# EAGLE board SDA381V7_B1 (EAGLE 9.6.2), part 1 of 11
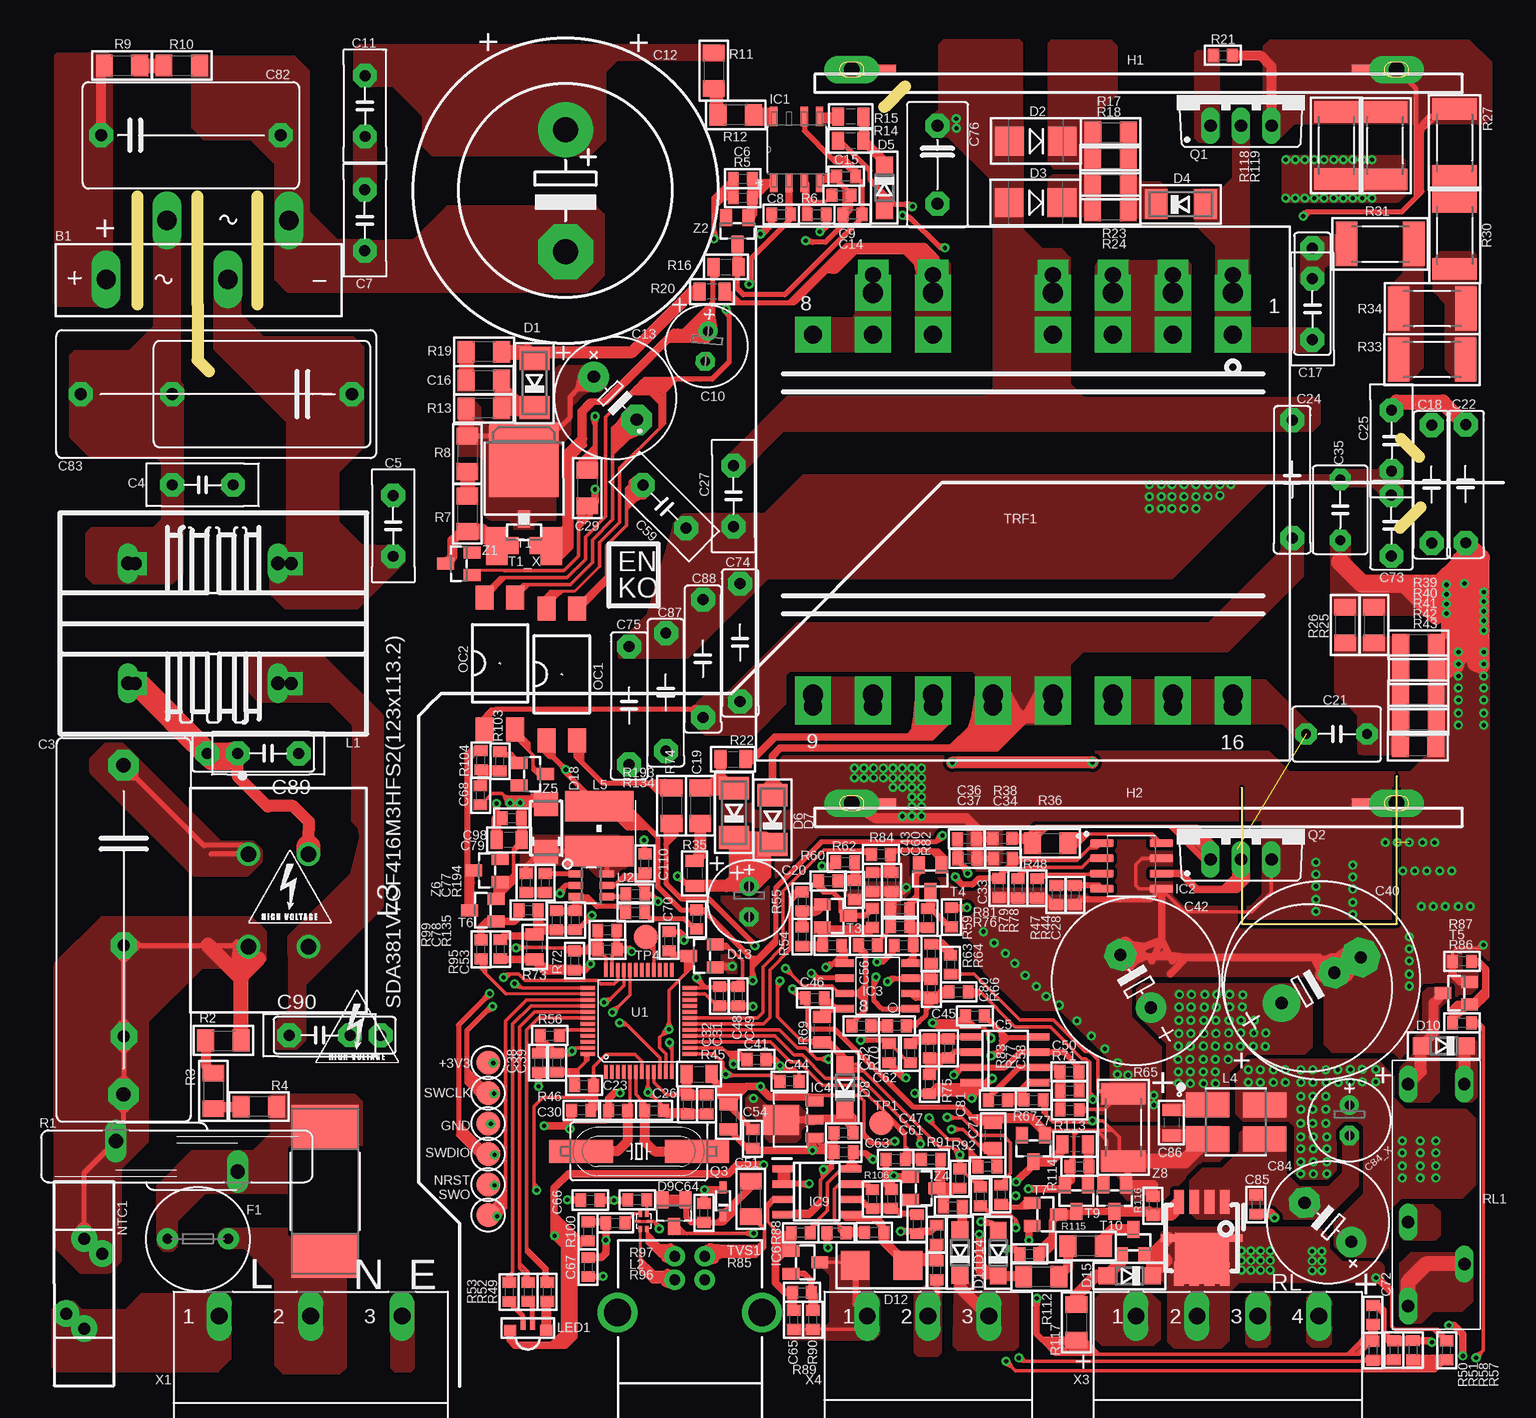
[diagram p2: board, top side]
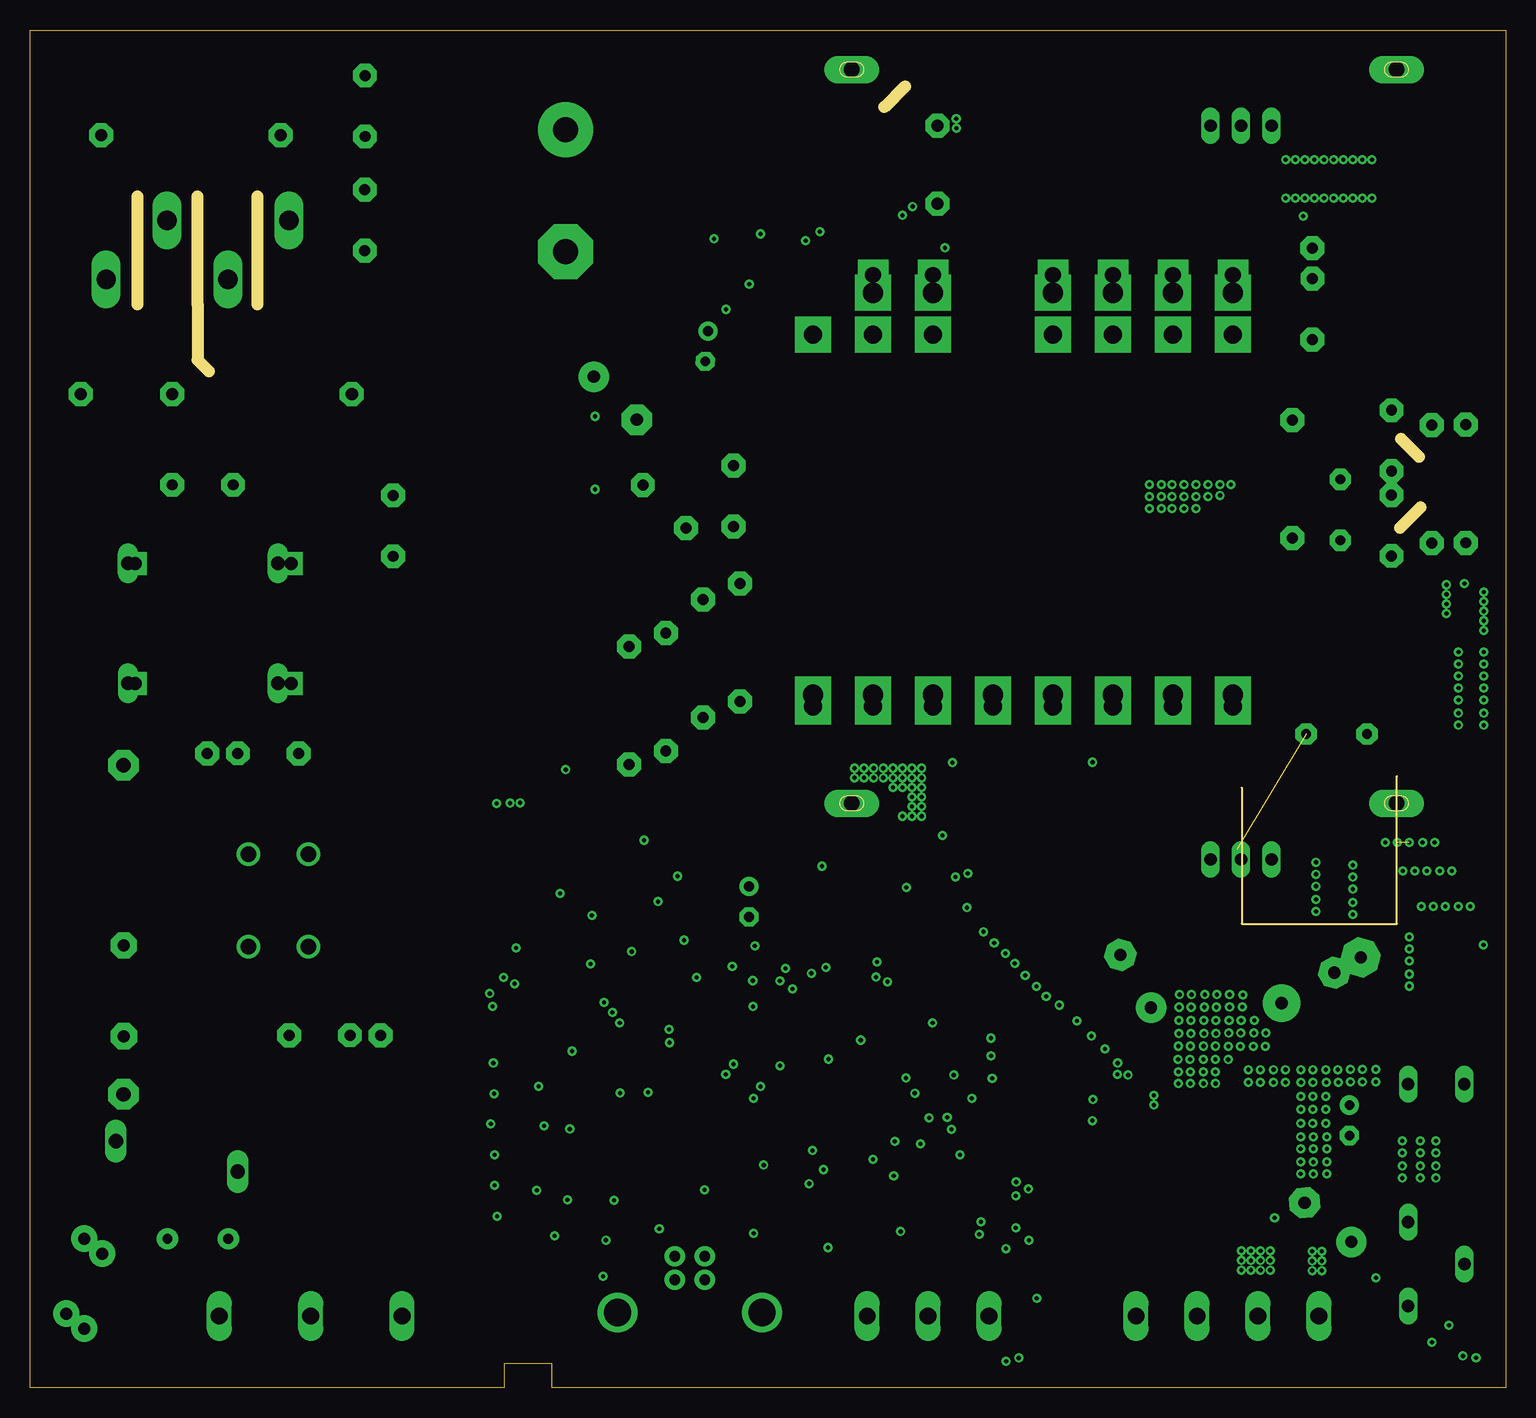
[diagram p3: board, inner layer Route3]
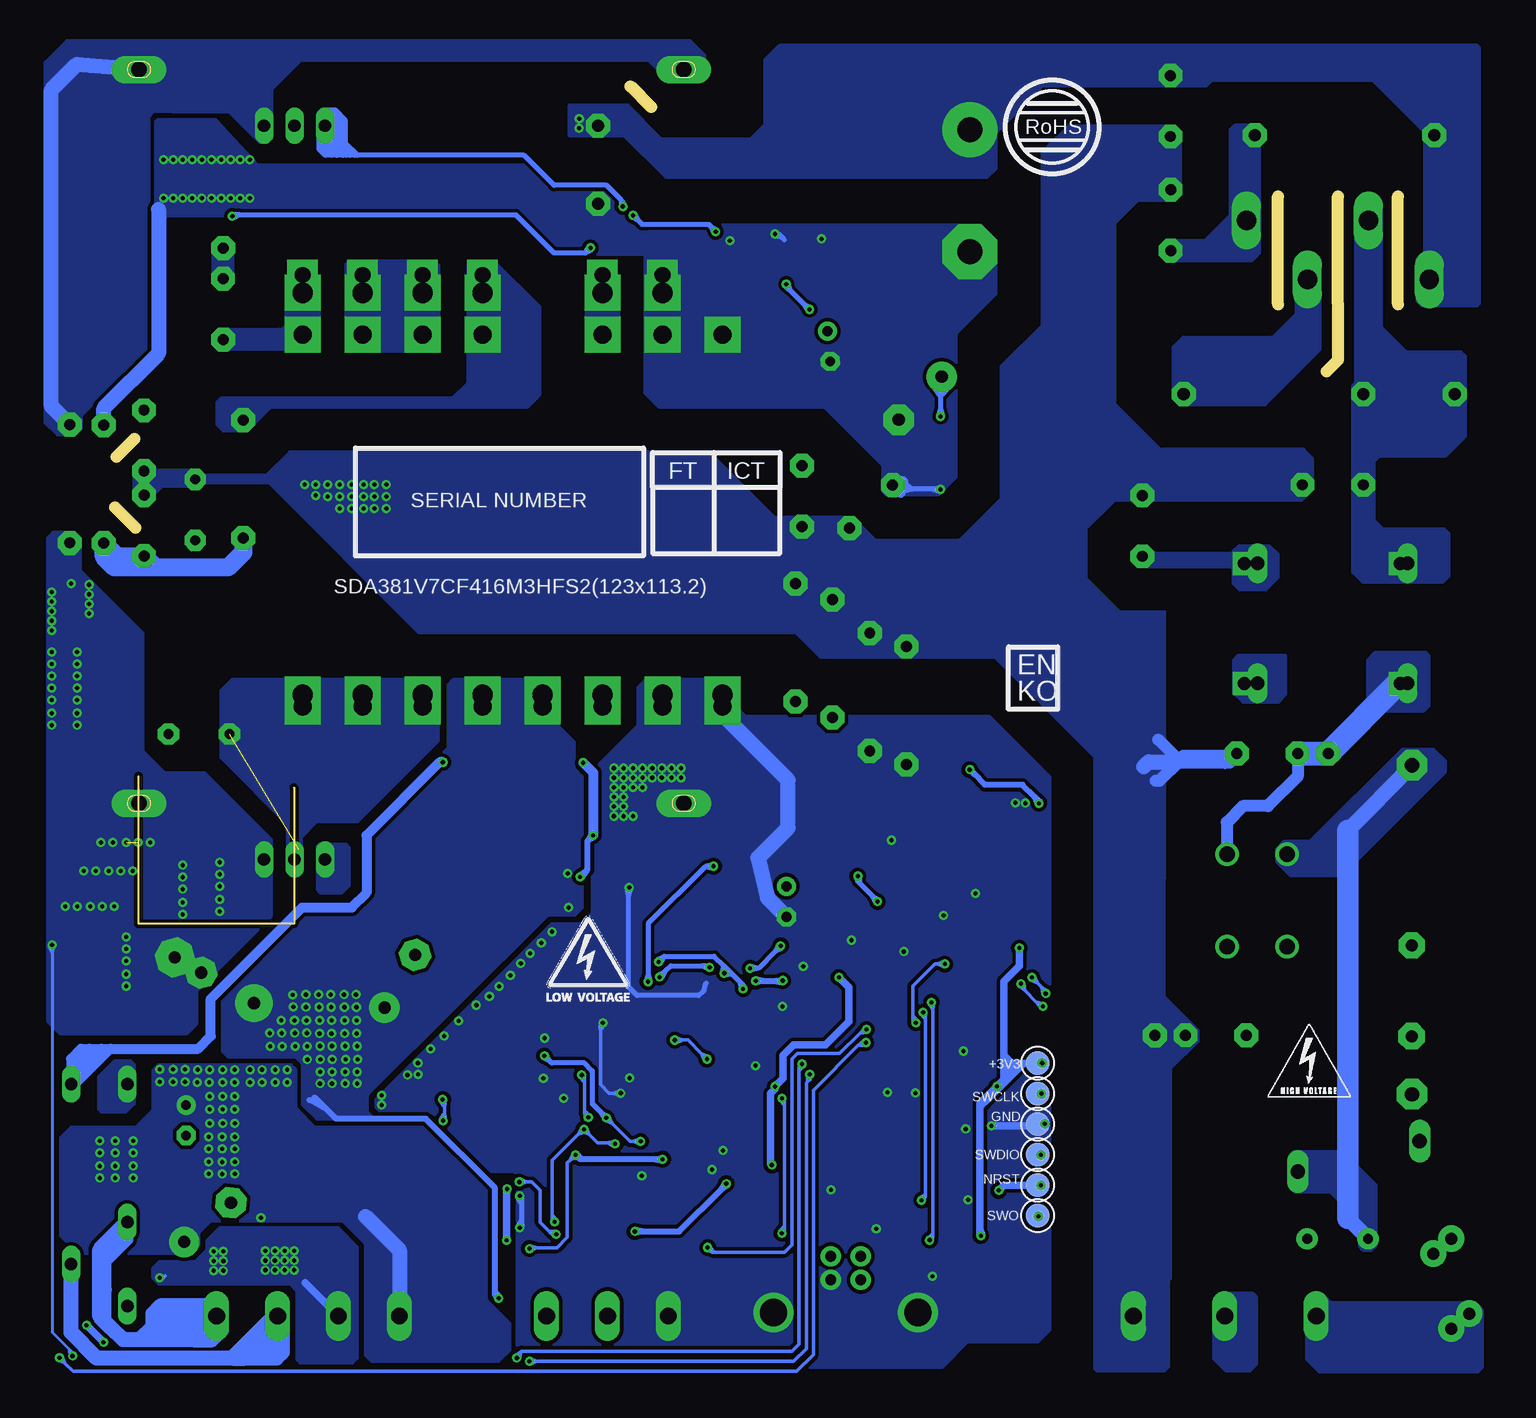
[diagram p4: board, bottom side, seen from below]

Size 12.95 x 12.3 mm. Coordinates in mm from the lower left corner, seen from the top.
Outline: 0,11.35 0,0 12.95,0 12.95,12.3
Copper layers (1*16): Top 0.035mm / dielectric 1.53mm / Bottom 0.035mm
Design rules "default *": minimum track width 10mil, minimum drill 0.008890625mm, track to track 11mil, track to pad 11mil, pad to pad 11mil, via to via 11mil, smd to smd 11mil, copper to edge 6mil, drill to drill 8mil, minimum pad ring 10mil, minimum via ring 8mil, stop-mask expansion 4mil, vias tented up to drill 0.35mm, thermal gap 10mil
Milling: 5 lines

## Footprints (pad centres in the part's own frame; a part is rotated, then mirrored left to right if it is on the bottom)
DıODE_BRIDGE_8A_DIK = drill 1.6 long: + -7.62,0.08; - 7.62,5; AC1 -2.54,5; AC2 2.54,0.08
C275-113X316_&_C150-072X183_&_C225-113X268 = drill 1.194 pad 2.54 octagon: 1 -13.716,0; 2 13.716,0 | drill 1.016 pad 2.184 octagon: 3 -13.733,0.02; 4 8.873,0.02; 5 -13.693,0; 6 1.293,0
C50-035X75 = drill 0.914 pad 1.981 octagon: 1 -2.54,0; 2 2.54,0
C0603_ENKO = smd 0.9 x 1.1: 1 -0.794,0; 2 0.794,0
E2,5-7 = drill 0.813 pad 1.6: + -1.27,0 | drill 0.813 pad 1.6 octagon: - 1.27,0
EB25D = drill 2.1 pad 4.597: + -5.08,0 | drill 2.1 pad 4.597 octagon: - 5.08,0
E5-10,5 = drill 1.016 pad 2.54: + -2.54,0 | drill 1.016 pad 2.54 octagon: - 2.54,0
C1206_ENKO = smd 1.4 x 1.8: 1 -1.479,0; 2 1.479,0
C075-32X103/C050-035X75 = drill 0.914 pad 2 octagon: 1 -3.81,0; 2 3.81,0 | drill 0.914 pad 1.981 octagon: 3 -3.81,0; 4 1.27,0
C075-32X103_DEIF = drill 0.914 pad 2 octagon: P$1 -4.92,0; P$2 4.92,0
C050-045X075 = drill 0.813 pad 1.778 octagon: 1 -2.54,0; 2 2.54,0
E5-13/E7,5-16 = drill 1.016 pad 3.15: + -3.81,0 | drill 1.016 pad 2.54: +1 -3.81,0 | drill 1.016 pad 3.15 octagon: - 3.81,0 | drill 1.016 pad 2.54 octagon: -1 1.27,0
E5-13 = drill 1.016 pad 2.54: + -2.54,0 | drill 1.016 pad 2.54 octagon: - 2.54,0
C0805_ENKO = smd 1 x 1.5: 1 -1.052,0; 2 1.052,0
C050-035X075 = drill 0.914 pad 1.981 octagon: 1 -2.54,0; 2 2.54,0
C065-052X106 = drill 1 pad 2 octagon: 1 -3.25,0; 2 3.25,0
C150-091X182 = drill 1 pad 2 octagon: 1 -7.493,0; 2 7.493,0
C150-091X182_C225-108X268 = drill 1.016 pad 2 octagon: 1 -11.303,0; 2 11.303,0; 3 -11.303,0; 4 3.683,0
M7_DC_DIYOT = smd 1.9 x 2.5: A -2.05,0; C 2.05,0
SMB = smd 2.4 x 2.4: A 2.2,0; C -2.2,0
SOD123 = smd 1.4 x 1.4: A 1.9,0; C -1.9,0
SOT23 = smd 1 x 1.4: 1 -0.95,-1.1; 2 0.95,-1.1; 3 0,1.1
TRANSIL_SMB = smd 2.4 x 2.4: A 2.2,0; A1 -2.2,0
SMA = smd 2 x 2: A 2,0; C -2,0
SENS_FUSE = drill 0.813 pad 1.778: 1 -2.54,0; 2 2.54,0
FUSE_1350HV_EAT = smd 3.658 x 5.563: 1 -5.372,0; 2 5.372,0
DEIF_SOGUTUCU_2 = drill 1.3 pad 2.3 long: 1 -23.9,0.91; 3 21.5,0.91 | smd 4.3 x 0.8: 2 -22.35,0.91; 4 19.95,0.91
NCP1239_SMPS_IC = smd 1.6 x 0.6: 1 -2.76,1.905; 2 -2.76,0.635; 3 -2.76,-0.635; 4 -2.76,-1.905; 5 2.76,-1.905; 6 2.76,-0.635; 8 2.76,1.905
NCP4306 = smd 1.97 x 0.6: 1 -2.475,1.905; 2 -2.475,0.635; 3 -2.475,-0.635; 4 -2.475,-1.905; 5 2.475,-1.905; 6 2.475,-0.635; 7 2.475,0.635; 8 2.475,1.905
SO-8 = smd 1.524 x 0.61: 1 -2.743,1.92; 2 -2.743,0.65; 3 -2.743,-0.62; 4 -2.743,-1.89; 5 2.743,-1.89; 6 2.743,-0.62; 7 2.743,0.65; 8 2.743,1.92
SOT89 = smd 0.8 x 1.5: 1 -1.5,-1.75; 2 0,-1.75; 3 1.5,-1.75 | smd 2.5 x 3: 4 0,1.05
SO08 = smd 0.6 x 1.8: 1 -1.905,-2.8; 2 -0.635,-2.8; 3 0.635,-2.8; 4 1.905,-2.8; 5 1.905,2.8; 6 0.635,2.8; 7 -0.635,2.8; 8 -1.905,2.8
TL431_SOT23F = smd 1 x 1.4: A 0,1.2; C -0.95,-1.2; R 0.95,-1.2
TPH6R30ANL = smd 0.8 x 2: D 1.905,3; D1 0.635,3; D2 -0.635,3; D3 -1.905,3; GATE 1.905,-3; S -1.905,-3; S1 -0.635,-3; S2 0.635,-3 | smd 1.27 x 0.635: P$1 -2.75,0; P$2 2.75,0 | smd 4.5 x 4.25: P$3 0,1.7
UU1620_&_FWCMET24V = drill 1.1 pad 1.93 square: 1 -5,-6.5; 2 5,-6.5; 3 -5,6.5; 4 5,6.5 | drill 1.118 long: 5 -5,-5.385; 6 5,-5.385; 7 4.999,7.115; 8 -5.001,7.113
EXC24CS_COMMON_MODE = smd 0.4 x 0.2: 1 -0.5,0; 4 0.5,0 | smd 0.3 x 0.5: 2 -0.275,-0.625; 3 0.275,-0.625; 5 0.275,0.625; 6 -0.275,0.625
WE-CMB_NIZN_S = drill 1.3: 1 -3.85,-2.5; 2 3.85,-2.5; 3 3.85,2.5; 4 -3.85,2.5
CM2021Y330R-10 = smd 3.66 x 2.085: 1 -2.375,1.423; 2 -2.375,-1.423; 3 2.375,-1.423; 4 2.375,1.423
WE-PD2_5MM = smd 2.55 x 5.7: 1 -1.875,0; 2 1.875,0
KPFA-3010RGBC-11 = smd 1 x 0.9: 1 1.5,-0.2; 2 -1.5,-0.2 | smd 0.4 x 0.8: 3 -0.4,0.25; 4 0.4,0.25
NTC_15R_2A_&_N15SP005-5 = drill 1 pad 2.184: P$1 -2.5,1.5; P$2 2.5,-1.5; P$3 3.75,0; P$4 -3.75,0
PS2561DL2-1_OPTO1 = smd 1.5 x 2: 1 -1.27,-5.5; 2 1.27,-5.5; 3 1.27,5.5; 4 -1.27,5.5
PROG_6PIN = smd 2 x 2: 1 0,6.35; 2 0,3.81; 3 0,1.27; 4 0,-1.27; 5 0,-3.81; 6 0,-6.35
TO220BV = drill 1.016 long: D 0,-2.54; G -2.54,-2.54; S 2.54,-2.54
HC49UP = smd 5.334 x 1.93: 1 -4.826,0; 2 4.826,0
S20K40 = drill 1.194 long: 1 -1.27,-5.08; 2 1.27,5.08
R1206_ENKO = smd 1.4 x 1.8: 1 -1.479,0; 2 1.479,0
R0603_ENKO = smd 0.9 x 1.1: 1 -0.794,0; 2 0.794,0
R0805_ENKO = smd 1 x 1.5: 1 -1.052,0; 2 1.052,0
R2512 = smd 1.8 x 3.7: 1 -2.8,0; 2 2.8,0
ALD1_AND_ALJ_RELAY = drill 1.016 pad 1.27 long: 1 -8.997,-2.129; 2 -8.998,2.565; P0 9.505,-2.132; P1 6.007,2.571; S0 2.507,-2.129
DPAK = smd 1.8 x 3.2: 1 -2.28,-4.8; 3 2.28,-4.8 | smd 5.8 x 6.2: 4 0,2.38
SOT23-BEC = smd 1 x 1.4: B -0.95,-1.1; C 0,1.1; E 0.95,-1.1
TP20R = smd 2 x 2: TP 0,0
DEIF_TRF = drill 1.7 pad 3 square: 1 -16.75,12.5; 2 -16.75,7.5; 3 -16.75,2.5; 5 -16.75,-7.5; 6 -16.75,-12.5; 6.5 16.75,-17.5; 7 16.75,-12.5; 8 16.75,-7.5; 9 16.75,-2.5; 10 16.75,2.5; 11 16.75,7.5; 12 16.75,12.5; 13 16.75,17.5; 55 -16.75,17.5 | drill 1.5 pad 3 square: 6.1 17.745,-17.5; 6.2 16.75,-17.5; 19 17.745,12.5; 20 17.745,7.5; 21 17.745,2.5; 22 17.745,-2.5; 23 17.745,-7.5; 24 17.745,-12.5; 25 17.745,17.5; 27 16.75,-12.5; 28 16.75,-7.5; 29 16.75,-2.5; 30 16.75,2.5; 31 16.75,7.5; 32 16.75,12.5; 38 16.75,17.5; 40 16.75,-17.5; 41 16.75,-12.5; 42 16.75,-7.5; 43 16.75,-2.5; 44 16.75,2.5; 45 16.75,7.5; 46 16.75,12.5; 47 16.75,17.5; 48 -13.25,-17.5; 49 -13.25,-12.5; 50 -13.25,-7.5; 52 -13.25,2.5; 53 -13.25,7.5; 54 -13.25,12.5; 58 -13.25,17.5 | drill 1.3 pad 2.54 square: 14 -18.255,-12.5; 15 -18.255,-7.5; 16 -18.255,2.5; 17 -18.255,7.5; 18 -18.255,12.5; 33 -18.25,-12.5; 34 -18.25,-7.5; 35 -18.25,2.5; 36 -18.25,7.5; 37 -18.25,12.5; 56 -18.255,17.5; 57 -18.25,17.5
SOD323 = smd 1 x 0.6: A 1.143,0; C -1.143,0
STM32F072CXXX_LQFP48 = smd 0.3 x 1.2: 1 -2.75,-4.25; 2 -2.25,-4.25; 3 -1.75,-4.25; 4 -1.25,-4.25; 5 -0.75,-4.25; 6 -0.25,-4.25; 7 0.25,-4.25; 8 0.75,-4.25; 9 1.25,-4.25; 10 1.75,-4.25; 11 2.25,-4.25; 12 2.75,-4.25; 25 2.75,4.25; 26 2.25,4.25; 27 1.75,4.25; 28 1.25,4.25; 29 0.75,4.25; 30 0.25,4.25; 31 -0.25,4.25; 32 -0.75,4.25; 33 -1.25,4.25; 34 -1.75,4.25; 35 -2.25,4.25; 36 -2.75,4.25 | smd 1.2 x 0.3: 13 4.25,-2.75; 14 4.25,-2.25; 15 4.25,-1.75; 16 4.25,-1.25; 17 4.25,-0.75; 18 4.25,-0.25; 19 4.25,0.25; 20 4.25,0.75; 21 4.25,1.25; 22 4.25,1.75; 23 4.25,2.25; 24 4.25,2.75; 37 -4.25,2.75; 38 -4.25,2.25; 39 -4.25,1.75; 40 -4.25,1.25; 41 -4.25,0.75; 42 -4.25,0.25; 43 -4.25,-0.25; 44 -4.25,-0.75; 45 -4.25,-1.25; 46 -4.25,-1.75; 47 -4.25,-2.25; 48 -4.25,-2.75
AOZ1282CI-1 = smd 1.2 x 0.6: 1 -1.298,0.95; 2 -1.298,0; 3 -1.298,-0.95; 4 1.298,-0.95; 5 1.298,0; 6 1.298,0.95
GMSTBA3 = drill 1.397 long: 1 -7.62,5.08; 2 0,5.08; 3 7.62,5.08
USB_B(YATIK) = drill 0.914 pad 1.676: D+ 4,1.25; D- 5.981,1.25; GND 4,-1.25; VBUS 5.981,-1.25 | drill 2.286: SHLD1 1.282,-6.02; SHLD2 1.282,6.02
MSTBA4 = drill 1.397 long: 1 -7.62,5.08; 2 -2.54,5.08; 3 2.54,5.08; 4 7.62,5.08
MSTBA3 = drill 1.397 long: 1 -5.08,5.08; 2 0,5.08; 3 5.08,5.08

## Placement (x,y rotation side)
B1  0119-1171**KOPRU DIYOT MONOFAZ 4A 1000V KBL  [DıODE_BRIDGE_8A_DIK]  -87.03,53.63 0 top  (outside the outline)
C3  0019-2207**CAP TH POLY 1uF 305Vac %10 X2 MKP F=22.5mm (12x22x26.5)  [C275-113X316_&_C150-072X183_&_C225-113X268]  -93.19,-0.51 270 top  (outside the outline)
C4  1200920292**CAP TH CER 2.2nF 300Vac %20 X1Y2 F=7.5mm DxS(13x5)  [C50-035X75]  -86.61,36.58 180 top  (outside the outline)
C5  1200920292**CAP TH CER 2.2nF 300Vac %20 X1Y2 F=7.5mm DxS(13x5)  [C50-035X75]  -70.72,33.17 90 top  (outside the outline)
C6  1200920252**CAP 0603 CER 1nF 50V %10 X7R  [C0603_ENKO]  -41.58,62.09 180 top  (outside the outline)
C7  1200920292**CAP TH CER 2.2nF 300Vac %20 X1Y2 F=7.5mm DxS(13x5)  [C50-035X75]  -73.09,58.65 270 top  (outside the outline)
C8  1200920252**CAP 0603 CER 1nF 50V %10 X7R  [C0603_ENKO]  -38.38,59.12 180 top  (outside the outline)
C9  1200920371**CAP 0603 CER 150p 50V%5 COG  [C0603_ENKO]  -33.36,60.72 180 top  (outside the outline)
C10  0019-2279**CAP TH AL ELEC 47uF 50V %20 105C F=2.5/6.3x11 Low ESR, High Ripple Current  [E2,5-7]  -44.6,48.14 265 top  (outside the outline)
C11  1200920292**CAP TH CER 2.2nF 300Vac %20 X1Y2 F=7.5mm DxS(13x5)  [C50-035X75]  -73.08,68.16 90 top  (outside the outline)
C12  0019-3039**150uF 450V 105C %20 Ba:10 Yu: 41,5 çap: 25  [EB25D]  -56.36,61.11 270 top  (outside the outline)
C13  0019-2196**CAP TH AL ELEC 47uF 100V %20 105C F=5/10x16  [E5-10,5]  -52.21,43.8 315 top  (outside the outline)
C14  1200920567**CAP 0603 CER 1uF 25V %10X7R  [C0603_ENKO]  -32.44,59.12 180 top  (outside the outline)
C15  1200920268**CAP 0603 CER 100nF 50V %10 X7R  [C0603_ENKO]  -32.97,62.3 180 top  (outside the outline)
C16  NC**TAKILMAYACAK (Not Fitted)  [C1206_ENKO]  -63.16,45.28 180 top  (outside the outline)
C17  0019-5007**CAP TH CER 150pF 630V COG %10 105C F=5  [C075-32X103/C050-035X75]  5.91,52.51 90 top  (outside the outline)
C18  0019-1298**CAP TH CER 1nF 500Vac X1/Y1 %20 F=10mm DxS(5x9)  [C075-32X103_DEIF]  15.84,36.63 90 top  (outside the outline)
C19  1200920078**CAP 1206 CER 1nF 50V %10 X7R  [C1206_ENKO]  -45.14,9.84 90 top  (outside the outline)
C20  1200920283**CAP TH AL. ELEC 47uF 50V %20 105C L?1000H F=2.5/6.3x11  [E2,5-7]  -41.06,1.84 270 top  (outside the outline)
C21  0019-1391**CAP TH CER 4700pF 250VAC 2.5kVDC X1Y2 %20 85C F=5mm  [C050-045X075]  7.92,15.81 0 top  (outside the outline)
C22  0019-1298**CAP TH CER 1nF 500Vac X1/Y1 %20 F=10mm DxS(5x9)  [C075-32X103_DEIF]  18.67,36.67 90 top  (outside the outline)
C23  1019-3352**CAP 0603 CER 22pF 50V %5 NPO  [C0603_ENKO]  -51.99,-15.55 180 top  (outside the outline)
C24  0019-1299**CAP TH CER 2.2nF 500Vac X1/Y1 %20 F=10mm DxS(5x12)  [C075-32X103_DEIF]  4.22,37.05 90 top  (outside the outline)
C25  NC**TAKILMAYACAK (Not Fitted)  [C50-035X75]  12.5,40.26 90 top  (outside the outline)
C26  1019-3352**CAP 0603 CER 22pF 50V %5 NPO  [C0603_ENKO]  -48.98,-15.57 0 top  (outside the outline)
C27  NC**TAKILMAYACAK (Not Fitted)  [C50-035X75]  -42.36,35.65 90 top  (outside the outline)
C28  1200920268**CAP 0603 CER 100nF 50V %10 X7R  [C0603_ENKO]  -13.88,2.4 90 top  (outside the outline)
C29  NC**TAKILMAYACAK (Not Fitted)  [C1206_ENKO]  -54.53,36.31 90 top  (outside the outline)
C30  1200920268**CAP 0603 CER 100nF 50V %10 X7R  [C0603_ENKO]  -55.05,-15.55 0 top  (outside the outline)
C31  1200920268**CAP 0603 CER 100nF 50V %10 X7R  [C0603_ENKO]  -44.59,-15.07 270 top  (outside the outline)
C32  1019-3167**CAP 0603 CER 10nF 50V %10 X7R (AbC)  [C0603_ENKO]  -46.19,-15.07 270 top  (outside the outline)
C33  1200920268**CAP 0603 CER 100nF 50V %10 X7R  [C0603_ENKO]  -20.23,2.98 90 top  (outside the outline)
C34  1200920567**CAP 0603 CER 1uF 25V %10X7R  [C0603_ENKO]  -19.89,5.44 0 top  (outside the outline)
C35  0019-1391**CAP TH CER 4700pF 250VAC 2.5kVDC X1Y2 %20 85C F=5mm  [C050-045X075]  8.23,34.5 90 top  (outside the outline)
C36  1200920268**CAP 0603 CER 100nF 50V %10 X7R  [C0603_ENKO]  -22.89,7.07 0 top  (outside the outline)
C37  1200920268**CAP 0603 CER 100nF 50V %10 X7R  [C0603_ENKO]  -22.86,5.42 0 top  (outside the outline)
C38  1200920268**CAP 0603 CER 100nF 50V %10 X7R  [C0603_ENKO]  -58.59,-11.59 90 top  (outside the outline)
C39  1019-3167**CAP 0603 CER 10nF 50V %10 X7R (AbC)  [C0603_ENKO]  -57.09,-11.58 90 top  (outside the outline)
C40  0019-3046**CAP TH AL ELEC 1000uF 35V %20 105C F=5/12.5x25 LOW ESR  [E5-13/E7,5-16]  6.63,-4.72 30 top
C41  1200920268**CAP 0603 CER 100nF 50V %10 X7R  [C0603_ENKO]  -40.43,-11.33 0 top  (outside the outline)
C42  0019-3046**CAP TH AL ELEC 1000uF 35V %20 105C F=5/12.5x25 LOW ESR  [E5-13]  -8.83,-4.8 120 top  (outside the outline)
C43  1019-3387**CAP 0603 CER 10uF 10V %10 X5R  [C0603_ENKO]  -32.28,2.82 90 top  (outside the outline)
C44  1200920268**CAP 0603 CER 100nF 50V %10 X7R  [C0603_ENKO]  -37.7,-13.14 0 top  (outside the outline)
C45  1200920268**CAP 0603 CER 100nF 50V %10 X7R  [C0603_ENKO]  -22.22,-7.68 180 top  (outside the outline)
C46  1200920268**CAP 0603 CER 100nF 50V %10 X7R  [C0603_ENKO]  -35.58,-6.19 0 top  (outside the outline)
C47  1200920567**CAP 0603 CER 1uF 25V %10X7R  [C0603_ENKO]  -33.18,-17.43 180 top  (outside the outline)
C48  1019-3167**CAP 0603 CER 10nF 50V %10 X7R (AbC)  [C0603_ENKO]  -43.53,-6.05 270 top  (outside the outline)
C49  1200920268**CAP 0603 CER 100nF 50V %10 X7R  [C0603_ENKO]  -41.97,-6.05 270 top  (outside the outline)
C50  NC**TAKILMAYACAK (Not Fitted)  [C0603_ENKO]  -14.35,-12.34 0 top  (outside the outline)
C51  1200920268**CAP 0603 CER 100nF 50V %10 X7R  [C0603_ENKO]  -40.76,-17.94 270 top  (outside the outline)
C52  1019-3158**CAP 0603 CER 220nF 25V %10 X7R (AbC)  [C0603_ENKO]  -31.7,-8.5 180 top  (outside the outline)
C53  1200920268**CAP 0603 CER 100nF 50V %10 X7R  [C0603_ENKO]  -61.79,-2.13 90 top  (outside the outline)
C54  1019-3301**CAP 0805 47uF 6.3V %20 X5R  [C0805_ENKO]  -42.77,-16.11 270 top  (outside the outline)
C55  1019-3167**CAP 0603 CER 10nF 50V %10 X7R (AbC)  [C0603_ENKO]  -52.86,-2.16 0 top  (outside the outline)
C56  1019-3158**CAP 0603 CER 220nF 25V %10 X7R (AbC)  [C0603_ENKO]  -31.14,-1.8 180 top  (outside the outline)
C57  1200920268**CAP 0603 CER 100nF 50V %10 X7R  [C0603_ENKO]  -52.88,-0.55 0 top  (outside the outline)
C58  1200920371**CAP 0603 CER 150p 50V%5 COG  [C0603_ENKO]  -24.43,-10.4 90 top  (outside the outline)
C59  NC**TAKILMAYACAK (Not Fitted)  [C50-035X75]  -48.12,34.77 135 top  (outside the outline)
C60  1019-3387**CAP 0603 CER 10uF 10V %10 X5R  [C0603_ENKO]  -30.76,3.48 90 top  (outside the outline)
C61  1200920268**CAP 0603 CER 100nF 50V %10 X7R  [C0603_ENKO]  -33.16,-19.04 180 top  (outside the outline)
C62  1200920268**CAP 0603 CER 100nF 50V %10 X7R  [C0603_ENKO]  -29.37,-10.78 90 top  (outside the outline)
C63  1019-3167**CAP 0603 CER 10nF 50V %10 X7R (AbC)  [C0603_ENKO]  -28.84,-19.64 180 top  (outside the outline)
C64  1200920268**CAP 0603 CER 100nF 50V %10 X7R  [C0603_ENKO]  -44.83,-24.11 90 top  (outside the outline)
C65  1200920268**CAP 0603 CER 100nF 50V %10 X7R  [C0603_ENKO]  -37.34,-33.03 90 top  (outside the outline)
C66  1019-3381**CAP 0603 CER 33pf 50V %5 NPO(COG)  [C0603_ENKO]  -54.29,-23.04 180 top  (outside the outline)
C67  1019-3381**CAP 0603 CER 33pf 50V %5 NPO(COG)  [C0603_ENKO]  -54.47,-28.62 270 top  (outside the outline)
C68  1200920268**CAP 0603 CER 100nF 50V %10 X7R  [C0603_ENKO]  -63.45,10.71 90 top  (outside the outline)
C69  1200920268**CAP 0603 CER 100nF 50V %10 X7R  [C0603_ENKO]  -21.77,-22.74 90 top  (outside the outline)
C70  1200920268**CAP 0603 CER 100nF 50V %10 X7R  [C0603_ENKO]  -47.74,-1.47 270 top  (outside the outline)
C71  1200920082**CAP 0805 CER 100nF 50V %10 X7R  [C0805_ENKO]  -20.71,-17.64 90 top  (outside the outline)
C72  1019-3167**CAP 0603 CER 10nF 50V %10 X7R (AbC)  [C0603_ENKO]  10.95,-32.6 270 top  (outside the outline)
C73  0019-1391**CAP TH CER 4700pF 250VAC 2.5kVDC X1Y2 %20 85C F=5mm  [C050-035X075]  12.49,33.2 90 top  (outside the outline)
C74  0019-1391**CAP TH CER 4700pF 250VAC 2.5kVDC X1Y2 %20 85C F=5mm  [C075-32X103_DEIF]  -41.8,23.45 90 top  (outside the outline)
C75  0019-1391**CAP TH CER 4700pF 250VAC 2.5kVDC X1Y2 %20 85C F=5mm  [C075-32X103_DEIF]  -51.05,18.2 90 top  (outside the outline)
C76  NC**TAKILMAYACAK (Not Fitted)  [C065-052X106]  -25.36,63.28 270 top  (outside the outline)
C77  1200920268**CAP 0603 CER 100nF 50V %10 X7R  [C0603_ENKO]  -59.64,3.4 90 top  (outside the outline)
C78  1019-3352**CAP 0603 CER 22pF 50V %5 NPO  [C0603_ENKO]  -57.11,0.28 270 top  (outside the outline)
C79  1019-3243**CAP 0805 CER 10uF 50V ±10% X5R -55°C ~ 85°C  [C0805_ENKO]  -61.07,6.97 180 top  (outside the outline)
C80  NC**TAKILMAYACAK (Not Fitted)  [C0603_ENKO]  -25.87,-5.44 90 top  (outside the outline)
C81  NC**TAKILMAYACAK (Not Fitted)  [C0603_ENKO]  -20.31,-14.71 0 top  (outside the outline)
C82  NC**TAKILMAYACAK (Not Fitted)  [C150-091X182]  -87.59,65.72 0 top  (outside the outline)
C83  0019-1383**CAP TH POLY 220nF 305Vac 105C %20 X2 F=15/7x13.5x18  [C150-091X182_C225-108X268]  -85.47,44.14 180 top  (outside the outline)
C84  0019-7012**CAP TH AL. ELEC 470uF 35V %20 105C F=5/10X16 L.ESR 3000H  [E5-10,5]  7.2,-24.9 140 top  (outside the outline)
C84_X  NC**TAKILMAYACAK (Not Fitted)  [E2,5-7]  8.99,-16.39 270 top  (outside the outline)
C85  1200920268**CAP 0603 CER 100nF 50V %10 X7R  [C0603_ENKO]  1.2,-23.41 90 top  (outside the outline)
C86  1200920082**CAP 0805 CER 100nF 50V %10 X7R  [C0805_ENKO]  -5.85,-16.58 270 top  (outside the outline)
C87  0019-3044**CAP TH CER 1nF 400VAC X1 %20 85C F=5 veya F=7.5 D=6.5  [C075-32X103_DEIF]  -48,19.3 90 top  (outside the outline)
C88  0019-3044**CAP TH CER 1nF 400VAC X1 %20 85C F=5 veya F=7.5 D=6.5  [C075-32X103_DEIF]  -44.9,22.1 90 top  (outside the outline)
C89  0019-1296**CAP TH CER 470pF 300Vac X1/Y2 %20 F=7.5mm DxS(5x8)  [C075-32X103/C050-035X75]  -82.4,14.2 180 top  (outside the outline)
C90  0019-1296**CAP TH CER 470pF 300Vac X1/Y2 %20 F=7.5mm DxS(5x8)  [C075-32X103/C050-035X75]  -75.6,-9.3 0 top  (outside the outline)
C98  1200920252**CAP 0603 CER 1nF 50V %10 X7R  [C0603_ENKO]  -60.83,8.79 180 top  (outside the outline)
C110  1200920268**CAP 0603 CER 100nF 50V %10 X7R  [C0603_ENKO]  -49.74,5.02 270 top  (outside the outline)
D1  1200980554**DIODE SWITCHING SM 1000V 1A US1M  [M7_DC_DIYOT]  -58.94,45.06 270 top  (outside the outline)
D2  1119-3074**P6SMB300CA - DIODE TVS 600W 256V DO214AA (SMB)  [SMB]  -17.16,65.24 180 top  (outside the outline)
D3  1119-3074**P6SMB300CA - DIODE TVS 600W 256V DO214AA (SMB)  [SMB]  -17.18,60.11 180 top  (outside the outline)
D4  1200980554**DIODE SWITCHING SM 1000V 1A US1M  [M7_DC_DIYOT]  -5.07,59.96 180 top  (outside the outline)
D5  NC**AKILMAYACAK (Not Fitted)  [SOD123]  -29.78,61.35 270 top  (outside the outline)
D6  1200980554**DIODE SWITCHING SM 1000V 1A US1M  [M7_DC_DIYOT]  -42.31,9.24 270 top  (outside the outline)
D7  1200980468**DIODE RECTIFIER SMD 1000V 1A GS1M  [M7_DC_DIYOT]  -39.11,8.66 270 top  (outside the outline)
D8  1200980377**DIODE SWITCHING SMD 75V 200mA SOD-123 1N4148W  [SOD123]  -33.05,-13.65 90 top  (outside the outline)
D9  1119-3027**DIODE 75V 200MA SOT23 BAS16 (AbC)  [SOT23]  -47.32,-24.13 180 top  (outside the outline)
D10  1200980377**DIODE SWITCHING SMD 75V 200mA SOD-123 1N4148W  [SOD123]  16.85,-10.18 180 top  (outside the outline)
D11  1200980377**DIODE SWITCHING SMD 75V 200mA SOD-123 1N4148W  [SOD123]  -23.48,-27.42 90 top  (outside the outline)
D12  1119-3072**DIODE TVS 600W 12V DO214AA BIPOLAR  [TRANSIL_SMB]  -30.01,-28.48 0 top  (outside the outline)
D13  1200980593**DIODE SCHOTTKY BARRIER DOUBLE SMD 30V 200mA BAT54S  [SOT23]  -44.98,-2.69 90 top  (outside the outline)
D14  1200980377**DIODE SWITCHING SMD 75V 200mA SOD-123 1N4148W  [SOD123]  -20.29,-27.46 90 top  (outside the outline)
D15  1200980377**DIODE SWITCHING SMD 75V 200mA SOD-123 1N4148W  [SOD123]  -9.34,-29.36 180 top  (outside the outline)
D18  1200980432**DIODE SCHOTTKY RECTIFIER SMD SMA/DO_214AC 60V 2A STPS2L60A  [SMA]  -57.99,7.96 90 top  (outside the outline)
F1  NC**TAKILMAYACAK  [SENS_FUSE]  -87.01,-26.28 0 top  (outside the outline)
F2  1169-1203**FUSE SMD 5A 350VAC 500VDC 2-SMD Breaking Cap: 100A I2t:11.5  [FUSE_1350HV_EAT]  -76.4,-22.3 90 top  (outside the outline)
H1  0139-1131**DBC2 90/150W Heatsink Düz Formlu [ARGE?]  [DEIF_SOGUTUCU_2]  -8.59,70.3 0 top  (outside the outline)
H2  0139-1131**DBC2 90/150W Heatsink Düz Formlu [ARGE?]  [DEIF_SOGUTUCU_2]  -8.59,9.12 0 top
IC1  1039-9014**IC SMPS CONTROLLER FLYBACK FIXED FREQ. ONSEMI NCP1239ED65R2G  [NCP1239_SMPS_IC]  -37.09,64.54 90 top  (outside the outline)
IC2  1039-9013**NCP4306AADZZZADR2G SOIC-8 (senkron IC) Synchronous Rectification Controller for Flyback  [NCP4306]  -9.17,4.81 0 top  (outside the outline)
IC3  1039-2224**TSM1011ID SO-8 Constant Voltage and Constant Current Controller  [SO-8]  -30.34,-5.17 180 top  (outside the outline)
IC4  1039-3003**Voltage Regulator SOT-89 3.3V Diodes AP2204RA-3.3TRG1  [SOT89]  -37.35,-16.34 90 top  (outside the outline)
IC5  1039-2009**OPAMP 3-32 V Dual 70C SO8 LM358  [SO08]  -19.72,-11.34 270 top  (outside the outline)
IC6  1200980448**IC REGULATOR VOLTAGE SMD ZTL431AFFTA 2.5V %1  [TL431_SOT23F]  -36.37,-28.24 270 top  (outside the outline)
IC8  1109-4211**Mosfet N-Ch 100V 90A Rds:3.7mR 8-SOP Advance (5x5) TPH3R70APL  [TPH6R30ANL]  -3.33,-26.2 180 top  (outside the outline)
IC9  1039-2009**OPAMP 3-32 V Dual 70C SO8 LM358  [SO08]  -35.41,-22.35 270 top  (outside the outline)
L1  0319-5030**LINE FILTER 2x7mH 1,5A COMMON MODE CHOKE (UU1620)  [UU1620_&_FWCMET24V]  -85.72,25.03 90 top  (outside the outline)
L2  1319-4100**EXC24 Common Mode Noise Filters with ESD Suppressor(0504 Size)  [EXC24CS_COMMON_MODE]  -49.85,-24.8 0 top  (outside the outline)
L3  0319-7457**Common Mode Chokes / Filters WE-CMB Power Type S 42uH 100kHz 8.1mOhm 744842742  [WE-CMB_NIZN_S]  -80.3,1.95 270 top  (outside the outline)
L4  NC**TAKILMAYACAK (Not Fitted)  [CM2021Y330R-10]  -0.46,-16.52 0 top  (outside the outline)
L5  1319-4102**INDUCTOR POWER 22UH 4X4X1.8MM SMD  [WE-PD2_5MM]  -53.56,7.93 270 top  (outside the outline)
LED1  1209-0011**LED, RGB, Red, Green, Blue, SMD, 1mm x 3mm, 120 °, Dome, R 20mA, G 20mA, B 20mA (Right Angle)  [KPFA-3010RGBC-11]  -59.5,-33.7 0 top  (outside the outline)
NTC1  0169-2029**SURGE PROTECTOR-In rush Current Limitter NTC N10SP005  [NTC_15R_2A_&_N15SP005-5]  -96.48,-30 270 top  (outside the outline)
OC1  1200980560**OPTOCOUPLER SMD PS2561DL2-1Y-V-F3-A/L CTR: 200˜400  [PS2561DL2-1_OPTO1]  -56.66,20.78 0 top  (outside the outline)
OC2  1200980560**OPTOCOUPLER SMD PS2561DL2-1Y-V-F3-A/L CTR: 200˜400  [PS2561DL2-1_OPTO1]  -61.82,21.7 0 top  (outside the outline)
PCB  0369-5106**PCB [ARGE?] SDA381V7CF416M3HFS2(123x113.2)  [PCB]  -106.84,70.22 0 top  (outside the outline)
PROG1  NC**TAKILMAYACAK (Not Fitted)  [PROG_6PIN]  -62.02,-17.99 0 bottom  (outside the outline)
PROG2  NC**TAKILMAYACAK (Not Fitted)  [PROG_6PIN]  -62.81,-17.93 0 top  (outside the outline)
Q1  0109-4091**Mosfet N-Ch 800V 9A 0.16R TO-220FP Vishay SIHA24N80AE-GE3 [ARGE?]  [TO220BV]  -0.05,69.06 0 top  (outside the outline)
Q2  1109-4204**Mosfet N-Ch 100V 64A Rds:4.5mR TO-220FP  [TO220BV]  -0.05,7.89 0 top
Q3  1149-0006**HC49S SMD KRISTAL 8MHZ -40+85 20PF 50PPM FAT Y3MM  [HC49UP]  -50.24,-18.97 0 top  (outside the outline)
R1  0169-2013**Varistor 20mm 300V  [S20K40]  -88.77,-19.39 270 top  (outside the outline)
R2  1200970587**RES 1206 470K %5 1/4W  [R1206_ENKO]  -84.87,-9.73 180 top  (outside the outline)
R3  1200970587**RES 1206 470K %5 1/4W  [R1206_ENKO]  -85.72,-13.93 90 top  (outside the outline)
R4  1200970587**RES 1206 470K %5 1/4W  [R1206_ENKO]  -81.91,-15.26 0 top  (outside the outline)
R5  1200970687**RES 0603 56K %1 1/10W  [R0603_ENKO]  -41.58,60.52 0 top  (outside the outline)
R6  1200970583**RES 0603 1K %1 1/10W  [R0603_ENKO]  -35.41,59.13 0 top  (outside the outline)
R7  1029-4050**RES 1206 6K8 %1  [R1206_ENKO]  -64.54,34.17 90 top  (outside the outline)
R8  1029-4050**RES 1206 6K8 %1  [R1206_ENKO]  -64.53,39.16 90 top  (outside the outline)
R9  1200970179**RES 1206 330K %5 1/4W  [R1206_ENKO]  -93.32,71.54 180 top  (outside the outline)
R10  1200970179**RES 1206 330K %5 1/4W  [R1206_ENKO]  -88.35,71.53 180 top  (outside the outline)
R11  1200970154**RES 1206 2K2 %5 1/4W  [R1206_ENKO]  -44.01,71.1 90 top  (outside the outline)
R12  1200970154**RES 1206 2K2 %5 1/4W  [R1206_ENKO]  -42.16,67.42 0 top  (outside the outline)
R13  1029-3146**RES 1206 7R68 %1  [R1206_ENKO]  -63.17,42.94 0 top  (outside the outline)
R14  1200970118**RES 0805 100R %5 1/8W  [R0805_ENKO]  -32.59,65.29 0 top  (outside the outline)
R15  1200970434**RES 0805 47R %5 1/8W  [R0805_ENKO]  -32.59,67.28 180 top  (outside the outline)
R16  1319-4060**Ferrite Bead SMD 0805 2kOhm@100MHz 300mA LAIRD HZ0805C202R-10  [R0805_ENKO]  -42.98,54.75 0 top  (outside the outline)
R17  1029-3146**RES 1206 7R68 %1  [R1206_ENKO]  -10.91,65.93 0 top  (outside the outline)
R18  1029-3146**RES 1206 7R68 %1  [R1206_ENKO]  -10.93,63.74 0 top  (outside the outline)
R19  NC**TAKILMAYACAK (Not Fitted)  [R1206_ENKO]  -63.16,47.66 0 top  (outside the outline)
R20  1319-4060**Ferrite Bead SMD 0805 2kOhm@100MHz 300mA LAIRD HZ0805C202R-10  [R0805_ENKO]  -44.15,52.68 180 top  (outside the outline)
R21  1200970568**RES 0603 47K %5 1/10W  [R0603_ENKO]  -1.56,72.38 180 top  (outside the outline)
R22  1319-4060**Ferrite Bead SMD 0805 2kOhm@100MHz 300mA LAIRD HZ0805C202R-10  [R0805_ENKO]  -42.4,13.71 0 top  (outside the outline)
R23  1029-3146**RES 1206 7R68 %1  [R1206_ENKO]  -10.93,61.6 0 top  (outside the outline)
R24  1029-3146**RES 1206 7R68 %1  [R1206_ENKO]  -10.93,59.48 0 top  (outside the outline)
R25  1200970119**RES 1206 100R %5 1/4W  [R1206_ENKO]  11.05,24.89 90 top  (outside the outline)
R26  1200970119**RES 1206 100R %5 1/4W  [R1206_ENKO]  8.64,24.89 90 top  (outside the outline)
R27  1029-6097**RES 2512 22R %5 1W  [R2512]  17.75,65.11 270 top  (outside the outline)
R30  1029-6097**RES 2512 22R %5 1W  [R2512]  17.76,57.37 270 top  (outside the outline)
R31  1029-6097**RES 2512 22R %5 1W  [R2512]  11.55,56.66 0 top  (outside the outline)
R33  1029-6110**RES 2512 47R %5 1W  [R2512]  15.88,47.02 180 top  (outside the outline)
R34  1029-6110**RES 2512 47R %5 1W  [R2512]  15.89,51.27 180 top  (outside the outline)
R35  1029-3008**RES 0805 22R %5  [R0805_ENKO]  -45.61,4.18 270 top  (outside the outline)
R36  1200970117**RES 1206 0R %5  [R1206_ENKO]  -15.95,6.71 180 top  (outside the outline)
R38  1200970568**RES 0603 47K %5 1/10W  [R0603_ENKO]  -19.93,7.1 180 top  (outside the outline)
R39  1200970119**RES 1206 100R %5 1/4W  [R1206_ENKO]  14.74,23.25 0 top  (outside the outline)
R40  1200970119**RES 1206 100R %5 1/4W  [R1206_ENKO]  14.74,21.17 0 top  (outside the outline)
R41  1200970119**RES 1206 100R %5 1/4W  [R1206_ENKO]  14.73,19.08 0 top  (outside the outline)
R42  1200970119**RES 1206 100R %5 1/4W  [R1206_ENKO]  14.74,16.94 0 top  (outside the outline)
R43  1200970554**RES 1206 56R %1 1/4W  [R1206_ENKO]  14.7,14.78 0 top
R44  1200970568**RES 0603 47K %5 1/10W  [R0603_ENKO]  -15.46,2.4 270 top  (outside the outline)
R45  1319-4060**Ferrite Bead SMD 0805 2kOhm@100MHz 300mA LAIRD HZ0805C202R-10  [R0805_ENKO]  -45.24,-12.54 0 top  (outside the outline)
R46  1200971020**RES 0603 10K %1 1/10W  [R0603_ENKO]  -54.82,-13.47 0 top  (outside the outline)
R47  1200971020**RES 0603 10K %1 1/10W  [R0603_ENKO]  -17.05,2.95 270 top  (outside the outline)
R48  1200970516**RES 0603 22K %5 1/10W  [R0603_ENKO]  -18.64,2.95 270 top  (outside the outline)
R49  1029-2005**RES 0603 220R %1  [R0603_ENKO]  -57.88,-30.68 270 top  (outside the outline)
R50  1200970803**RES 0603 100K %1 1/10W  [R0603_ENKO]  10.95,-35.59 270 top  (outside the outline)
R51  1200971020**RES 0603 10K %1 1/10W  [R0603_ENKO]  12.71,-35.55 90 top  (outside the outline)
R52  1029-2005**RES 0603 220R %1  [R0603_ENKO]  -59.47,-30.69 270 top  (outside the outline)
R53  1029-2005**RES 0603 220R %1  [R0603_ENKO]  -61.05,-30.7 270 top  (outside the outline)
R54  1200971020**RES 0603 10K %1 1/10W  [R0603_ENKO]  -36.64,-1.09 90 top  (outside the outline)
R55  1029-2233**RES 0603 2K2 %1  [R0603_ENKO]  -36.64,1.86 90 top  (outside the outline)
R56  1200970522**RES 0603 1K %5 1/10W  [R0603_ENKO]  -57.66,-9.32 0 top  (outside the outline)
R57  1200970803**RES 0603 100K %1 1/10W  [R0603_ENKO]  17.09,-35.55 270 top  (outside the outline)
R58  1200970770**RES 0603 4K3 %1 1/10W  [R0603_ENKO]  14.29,-35.55 90 top  (outside the outline)
R59  1200970803**RES 0603 100K %1 1/10W  [R0603_ENKO]  -30.78,0.47 270 top  (outside the outline)
R60  1029-2234**RES 0603 4K7 %1  [R0603_ENKO]  -34.47,3.55 0 top  (outside the outline)
R61  1200970583**RES 0603 1K %1 1/10W  [R0603_ENKO]  -34.13,-1.8 0 top  (outside the outline)
R62  1200970706**RES 0603 1K8 %5 1/10W  [R0603_ENKO]  -33.04,5.12 0 top  (outside the outline)
R63  1029-2003**RES 0603 10R %1  [R0603_ENKO]  -25.88,-2.51 270 top  (outside the outline)
R64  1029-2006**RES 0603 47R %1  [R0603_ENKO]  -24.27,-3.41 90 top  (outside the outline)
R65  1029-6021**RES 2512 0R003 %1 2W  [R2512]  -9.86,-16.98 270 top  (outside the outline)
R66  1200970927**RES 0603 100R %1 1/10W  [R0603_ENKO]  -23.58,-5.7 0 top  (outside the outline)
R67  1200970522**RES 0603 1K %5 1/10W  [R0603_ENKO]  -17.34,-14.69 0 top  (outside the outline)
R68  1200970522**RES 0603 1K %5 1/10W  [R0603_ENKO]  -14.34,-15.53 180 top  (outside the outline)
R69  1029-3008**RES 0805 22R %5  [R0805_ENKO]  -34.97,-8.83 90 top  (outside the outline)
R70  1200970843**RES 0603 15K %1 1/10W  [R0603_ENKO]  -28.72,-8.51 0 top  (outside the outline)
R71  1029-2234**RES 0603 4K7 %1  [R0603_ENKO]  -14.33,-13.91 0 top  (outside the outline)
R72  1200970583**RES 0603 1K %1 1/10W  [R0603_ENKO]  -55.59,-3.07 90 top  (outside the outline)
R73  1169-1001**TSM2A103F3951RZ THINKING 0805 10K NTC 125C  [R0805_ENKO]  -58.92,-1.93 90 top  (outside the outline)
R74  1200970194**RES 1206 4K7 %5 1/4W  [R1206_ENKO]  -47.52,9.84 90 top  (outside the outline)
R75  1200970583**RES 0603 1K %1 1/10W  [R0603_ENKO]  -26.03,-13.37 90 top  (outside the outline)
R76  1200970684**RES 0603 47K %1 1/10W  [R0603_ENKO]  -28.46,-0.21 0 top  (outside the outline)
R77  1029-6089**RES 0603 6K8 %5  [R0603_ENKO]  -26.02,-10.4 90 top  (outside the outline)
R78  1029-2203**RES 0603 12K %1  [R0603_ENKO]  -24.18,0.53 90 top  (outside the outline)
R79  1029-2341**RES 0603 5K6 %1  [R0603_ENKO]  -26.17,0.46 90 top  (outside the outline)
R80  1029-2234**RES 0603 4K7 %1  [R0603_ENKO]  -28.17,-1.81 0 top  (outside the outline)
R81  1200970583**RES 0603 1K %1 1/10W  [R0603_ENKO]  -28.46,1.21 180 top  (outside the outline)
R82  1200971020**RES 0603 10K %1 1/10W  [R0603_ENKO]  -29.17,3.49 270 top  (outside the outline)
R83  1200970522**RES 0603 1K %5 1/10W  [R0603_ENKO]  -27.6,-10.79 270 top  (outside the outline)
R84  1200970522**RES 0603 1K %5 1/10W  [R0603_ENKO]  -30.06,5.78 0 top  (outside the outline)
R85  1169-1006**FUSE SMD 1206 PTC RESETTABLE 16V IHOLD=0.75A IMAX=100A  [R1206_ENKO]  -40.93,-22.94 270 top  (outside the outline)
R86  1200970522**RES 0603 1K %5 1/10W  [R0603_ENKO]  18.37,-8.27 0 top  (outside the outline)
R87  1200971020**RES 0603 10K %1 1/10W  [R0603_ENKO]  18.37,-3.14 0 top  (outside the outline)
R88  1029-2234**RES 0603 4K7 %1  [R0603_ENKO]  -36.76,-25.76 0 top  (outside the outline)
R89  1200970583**RES 0603 1K %1 1/10W  [R0603_ENKO]  -36.65,-30.74 180 top  (outside the outline)
R90  1029-2231**RES 0603 1K8 %1  [R0603_ENKO]  -35.75,-33.03 90 top  (outside the outline)
R91  1200971020**RES 0603 10K %1 1/10W  [R0603_ENKO]  -25.88,-19.65 0 top  (outside the outline)
R92  1200970568**RES 0603 47K %5 1/10W  [R0603_ENKO]  -23.48,-21.24 270 top  (outside the outline)
R93  1409-0025**RES 0603 470R %5 1/16W  [R0603_ENKO]  -24.07,-23.58 180 top  (outside the outline)
R94  1029-6086**RES 0603 22R %1  [R0603_ENKO]  -25.41,-28.91 90 top  (outside the outline)
R95  NC**TAKILMAYACAK  [R0603_ENKO]  -63.4,-2.15 270 top  (outside the outline)
R96  1029-6086**RES 0603 22R %1  [R0603_ENKO]  -52.2,-24.94 180 top  (outside the outline)
R97  1029-6086**RES 0603 22R %1  [R0603_ENKO]  -50.38,-23.02 180 top  (outside the outline)
R98  1029-2234**RES 0603 4K7 %1  [R0603_ENKO]  -25.42,-25.93 90 top  (outside the outline)
R99  NC**TAKILMAYACAK  [R0603_ENKO]  -59.44,1.13 180 top  (outside the outline)
R100  1200970852**RES 0603 1K5 %5 1/10W ( <-1029-3501 )  [R0603_ENKO]  -54.48,-25.65 270 top  (outside the outline)
R101  1200970684**RES 0603 47K %1 1/10W  [R0603_ENKO]  -27.05,-25.05 270 top  (outside the outline)
R102  1200970583**RES 0603 1K %1 1/10W  [R0603_ENKO]  -29.18,-22.95 270 top  (outside the outline)
R103  1200970522**RES 0603 1K %5 1/10W  [R0603_ENKO]  -61.83,13.54 90 top  (outside the outline)
R104  1200970522**RES 0603 1K %5 1/10W  [R0603_ENKO]  -63.4,13.63 270 top  (outside the outline)
R105  1029-2229**RES 0603 120K %1  [R0603_ENKO]  -30.62,-25.73 180 top  (outside the outline)
R106  1029-2219**RES 0603 30K %1  [R0603_ENKO]  -30.77,-22.96 90 top  (outside the outline)
R107  1200970515**RES 0603 100K %5 1/10W  [R0603_ENKO]  -17.69,-27.53 180 top  (outside the outline)
R108  1200970730**RES 0603 560R %1 1/10W  [R0603_ENKO]  -33.77,-25.76 180 top  (outside the outline)
R109  1200971020**RES 0603 10K %1 1/10W  [R0603_ENKO]  -20.05,-22.59 90 top  (outside the outline)
R110  1200970516**RES 0603 22K %5 1/10W  [R0603_ENKO]  -21.18,-20.26 180 top  (outside the outline)
R112  1200970156**RES 1206 22K %5 1/4W  [R1206_ENKO]  -16.7,-29.41 180 top  (outside the outline)
R113  1200970121**RES 0805 1K %5 1/8W  [R0805_ENKO]  -13.87,-18.4 180 top  (outside the outline)
R114  1200971020**RES 0603 10K %1 1/10W  [R0603_ENKO]  -13.51,-20.24 180 top  (outside the outline)
R115  1200970156**RES 1206 22K %5 1/4W  [R1206_ENKO]  -12.99,-26.87 0 top  (outside the outline)
R116  1200970585**RES 0603 1M %5 1/10W  [R0603_ENKO]  -7.39,-23.51 270 top  (outside the outline)
R117  1029-6015**RES 1206 56K %5  [R1206_ENKO]  -13.77,-33.23 90 top  (outside the outline)
R118  1029-6105**RES 2512 330mR %1 2W  [R2512]  7.92,64.87 90 top  (outside the outline)
R119  1029-6105**RES 2512 330mR %1 2W  [R2512]  11.97,64.85 90 top  (outside the outline)
R133  1200970626**RES 0603 82K %1 1/10W  [R0603_ENKO]  -45.44,0.35 90 top  (outside the outline)
R134  1029-2234**RES 0603 4K7 %1  [R0603_ENKO]  -50.55,0.96 0 top  (outside the outline)
R135  1200970940**RES 0603 6K8 %1 1/10W  [R0603_ENKO]  -55.54,0.29 90 top  (outside the outline)
R193  1200970934**RES 0603 470K %1 1/10W  [R0603_ENKO]  -50.55,2.47 0 top  (outside the outline)
R194  1200970528**RES 0603 0R %5 1/10W  [R0603_ENKO]  -58.05,3.4 270 top  (outside the outline)
RL1  1200930051**RELAY SPST 12V 5A 7x15x20.3mm  [ALD1_AND_ALJ_RELAY]  16.01,-22.37 270 top  (outside the outline)
STENCIL  041-7554**SDA381V7 için Çerçeveli Elek (Stencil) (600x600)  [PCB]  -106.88,66.87 0 top  (outside the outline)
T1  1109-1016**Transistor NPN 3A 100V 15W Hfemin:10 DPAK Diodes MJD31C-13  [DPAK]  -59.82,36.28 0 top  (outside the outline)
T1_X  NC**TAKILMAYACAK (Not Fitted)  [SOT23]  -59.82,32.62 0 top  (outside the outline)
T3  1200980091**TRANS SMD PNP BC857B SOT-23  [SOT23-BEC]  -33.86,0.65 270 top  (outside the outline)
T4  1200980090**TRANS SMD NPN BC847B SOT-23  [SOT23]  -25.96,3.78 180 top  (outside the outline)
T5  1200980090**TRANS SMD NPN BC847B SOT-23  [SOT23]  17.89,-5.79 90 top  (outside the outline)
T6  NC**TAKILMAYACAK  [SOT23]  -63.25,1.12 90 top  (outside the outline)
T7  1200980090**TRANS SMD NPN BC847B SOT-23  [SOT23]  -16.37,-24.24 270 top  (outside the outline)
T9  1200980090**TRANS SMD NPN BC847B SOT-23  [SOT23]  -13.77,-22.88 180 top  (outside the outline)
T10  1049-1012**MMBTA56 PNP 80V 500mA 330mW hfe(min):100 SOT23  [SOT23-BEC]  -9.04,-26.57 0 top  (outside the outline)
TP1  PTR1TP20R  [TP20R]  -30.04,-16.62 0 top  (outside the outline)
TP4  PTR1TP20R  [TP20R]  -49.67,-1.11 0 top  (outside the outline)
TRF1  0319-7458**SMPS TRAFO 90W E36/18/11 2*60uH (Insulation Improved 0319-7451) DBC2  [DEIF_TRF]  -18.23,35.83 270 top  (outside the outline)
TVS1  1119-3061**5V 130W TVS Diode SOD-323  [SOD323]  -43.22,-23.11 90 top  (outside the outline)
U1  1039-2220**STM32F072C8T6 64K Flash USB, CAN  [STM32F072CXXX_LQFP48]  -50.24,-8.1 0 top  (outside the outline)
U2  1039-2392**LMR16006XDDCR 0.6A, 0.7MHz Step-Down Converter in a TSOT-6L, Input 4V to 60V  [AOZ1282CI-1]  -54.2,3.2 0 top  (outside the outline)
U$1  [SERI_NO_ETIKET_ALANI]  -18.34,35.25 180 bottom  (outside the outline)
U$2  [EN-KO_AMLEMI]  -50.64,28.97 0 top  (outside the outline)
U$3  [EN-KO_AMLEMI]  -61.67,20.38 0 bottom  (outside the outline)
U$4  [ROHS]  -63.22,66.41 0 bottom  (outside the outline)
U$5  [FT-ICT]  -35.01,35.17 0 bottom  (outside the outline)
X1  0289-1472**WR-TBL Series 3134 - 3 kutup 7.62 mm Close Hor. PCB Header (Wurth 691 313 410 003)  [GMSTBA3]  -77.6,-37.79 0 top  (outside the outline)
X1-K  0289-1473**WR-TBL Series 3524 - 3 kutup 7.62 mm Hor. w. Hook on Wire Side (Wurth 691 352 410 003)  [SOKET]  -106.84,69.5 0 top  (outside the outline)
X2  0309-1064**USB Type-B Mini Connector Horizantal  [USB_B(YATIK)]  -46,-33.7 90 top  (outside the outline)
X3  0289-1470**WR-TBL Series 313 - 4 kutup 5.08 mm Close Hor. PCB Header (Wurth 691 313 510 004)  [MSTBA4]  -1.18,-37.79 0 top  (outside the outline)
X3-K  0289-1471**WR-TBL Series 352 - 4 kutup 5.08 mm Hor. with Hook on Wire Side (wurth 691 352 510 004)  [SOKET]  -106.84,68.76 0 top  (outside the outline)
X4  0289-1474**WR-TBL Series 313 - 3 kutup 5.08 mm Close Hor. PCB Header (Wurth 691 313 510 003)  [MSTBA3]  -26.13,-37.79 0 top  (outside the outline)
X4-K  0289-1475**WR-TBL Series 352 - 3 kutup 5.08 mm Hor. with Hook on Wire Side (wurth 691 352 510 003)  [SOKET]  -106.86,67.93 0 top  (outside the outline)
Z1  1129-1195**ZENER SOT23 18V 400mW %5 BZX84C18V  [SOT23]  -65.25,30 90 top  (outside the outline)
Z2  NC**TAKILMAYACAK (Not Fitted)  [SOT23]  -42.03,57.75 180 top  (outside the outline)
Z4  1129-1162**ZENER SOT23 3V9 300mW BZX84C3V9  [SOT23]  -26.5,-22.06 270 top  (outside the outline)
Z5  1129-1151**ZENER SOT23 12V 225mW BZX84C12  [SOT23]  -59.13,12.46 270 top  (outside the outline)
Z6  1129-1146**ZENER SOT23 2V7 300mW BZX84C2V7  [SOT23]  -62.9,4.44 90 top  (outside the outline)
Z7  1129-1151**ZENER SOT23 12V 225mW BZX84C12  [SOT23]  -17.35,-18.73 180 top  (outside the outline)
Z8  1129-1140**ZENER SOT23 5V1 0.4W BZX84C5V1  [SOT23]  -10.59,-22.88 180 top  (outside the outline)

## Tracks (layer width: path | path; a pad name or v marks a point on that pad's centre or on a via)
13.8V+  (via drill 0.35)
  Top 0.254: -63.5,17 -62.58,17.92 -62.31,17.92 -62.24,17.85
  Top 0.305: 9.51,-35.89 9.83,-35.89 10.92,-34.8 R50.1 | 9.51,-35.89 9.11,-35.89 | 9.11,-35.89 8.81,-35.89 | 8.81,-35.89 -11.85,-35.89 | R117.1 -13.03,-34.71 -11.85,-35.89 | 9.51,-35.89 10.7,-34.7 10.7,-34.3 | 9.11,-35.89 10.7,-34.3 | 10.7,-34.3 10.7,-34.1 | 8.81,-35.89 10.95,-33.75 C72.2 | -11.85,-35.89 -12.12,-35.89 | -13.29,-34.72 -12.12,-35.89 | -12.12,-35.89 -12.39,-35.89 | -12.39,-35.89 -13.37,-34.91 | -12.39,-35.89 -12.7,-35.89 | -12.7,-35.89 -13.58,-35.01 | -12.7,-35.89 -13.01,-35.89 | -13.84,-35.06 -13.01,-35.89 | -13.01,-35.89 -13.34,-35.89 | -14.21,-35.02 -13.34,-35.89 | -13.34,-35.89 -13.69,-35.89 | -13.69,-35.89 -14.51,-35.07 | -13.69,-35.89 -13.88,-35.89 | -13.88,-35.89 -14.94,-34.83 | -13.88,-35.89 -14.3,-35.89 | -15.48,-34.71 -14.3,-35.89 | -14.3,-35.89 -14.65,-35.89 | -14.65,-35.89 -15.83,-34.71 | -14.65,-35.89 -14.93,-35.89 | -16.11,-34.71 -14.93,-35.89 | -14.93,-35.89 -15.24,-35.89 | -15.24,-35.89 -16.42,-34.71 | -15.24,-35.89 -15.41,-35.89 | -15.41,-35.89 -16.59,-34.71 | -15.41,-35.89 -15.55,-35.89 -16.7,-34.74 | -63.09,16.29 OC2.1
  Top 0.406: -39.51,11.69 -39.11,12.1 -39.02,12.1 -38.32,11.4 | -39.51,11.69 -39.89,11.32 -39.92,11.32 | -39.92,11.32 -40.02,11.32 | C72.2 R50.1 | -39.92,10.5 -39.92,11.32 | -39.51,11.2 -39.51,11.69 | C88.P$1 -45.55,17.83 -45.57,17.85 -62.24,17.85 -63.09,17 OC2.1
  Top 0.508: D7.A -39.11,10.81 | -18.69,17.22 -18.96,17.22 | -21.19,18.62 -21.92,17.89 -21.92,17.6 -21.46,17.14 | -21.19,18.62 TRF1.43 | -21.03,18.47 -21.19,18.62 | TRF1.22 -20.69,18.06 -20.26,17.62 -20.13,17.62 | -16.88,17.93 -17.36,17.45 -17.68,17.45 | -16.88,17.93 -16.06,18.74 | -16.06,18.74 TRF1.44 -15.18,18.54 -15.18,17.95 | -18.65,17.45 -18.26,17.45 | -18.26,17.45 -18.19,17.45 | -18.19,17.45 -17.68,17.45 | -17.73,17.93 -16.88,17.93 | -17.93,17.15 -17.39,17.15 | -17.39,17.15 -16.82,17.15 -16.39,17.58 | -16.39,17.58 -16.06,17.9 -16.06,18.74 | -17.06,17.58 -16.39,17.58 | -16.09,18.09 TRF1.21 -15.73,17.99 | -18.56,17.74 -20.78,17.84 -18.56,17.74 | -23.05,4.65 -22.83,4.43 v-22.83,4.18 | -23.05,4.65 -23.14,4.74 | -23.14,4.74 -23.65,5.25 C37.1 | R117.1 -15.48,-34.71 -15.83,-34.71 -16.11,-34.71 -16.42,-34.71 -16.59,-34.71 -17.08,-34.22 -17.08,-31.88 | -17.08,-31.88 -17.08,-31.77 | -17.08,-31.77 v-17.08,-31.24 | -18.19,17.45 -17.52,17.27 | -17.52,17.27 -16.04,16.88 -18.19,17.45 | -18.19,17.45 -17.89,17.74 | -17.89,17.74 -16.59,18.99 -18.19,17.45 | -23.14,4.74 -22.95,4.14 | -23.14,4.74 -22.73,4.26 | -17.08,-31.88 -16.96,-31.26 | -16.96,-31.26 | v-17.08,-31.24 -16.96,-31.26 | -17.08,-31.88 -17.1,-31.76 | -17.2,-31.26 | v-17.08,-31.24 -17.2,-31.26 | -18.26,17.45 -18.56,17.74 | -18.56,17.74 -19.86,18.99 | -18.26,17.45 -20.41,16.88 | -18.93,17.27 -19.52,19.42 -18.93,17.27 | -18.56,17.74 -19.63,19.69 | -18.93,17.27 -21.07,17.89 | -17.68,17.45 -15.5,17.86 | -17.68,17.45 -16.89,19.53 | -17.39,17.15 -15.3,17.91 | -17.39,17.15 -16.95,19.33 | -17.52,17.27 -15.38,17.89 | -17.52,17.27 -16.93,19.42 | -17.89,17.74 -15.67,17.84 | -17.89,17.74 -16.82,19.69
  Top 0.508: -23.05,4.65 -22.95,4.15 v-22.83,4.18 | -23.05,4.65 -22.73,4.26 v-22.83,4.18 | -22.95,4.14 -23.1,4.63 -22.74,4.27 v-22.83,4.18 | v-22.83,4.18 -22.95,4.14 | v-22.83,4.18 -22.95,4.15 -23.06,4.65 -22.73,4.26 | v-22.83,4.18 -22.73,4.26 | -17.08,-31.77 -16.96,-31.27 v-17.08,-31.24 | -17.08,-31.77 -17.2,-31.27 v-17.08,-31.24 | -16.96,-31.26 -17.06,-31.76 -17.2,-31.28 v-17.08,-31.24 | v-17.08,-31.24 -16.96,-31.26 | -17.1,-31.76 -16.96,-31.28 v-17.08,-31.24 | -17.1,-31.76 -17.2,-31.26 | v-17.08,-31.24 -17.2,-31.26
  Top 0.61: R78.2 -22.91,1.33 v-22.9,1.34 | OC2.1 -63.09,15.99 | D7.A -39.11,12.1 -39.11,13.98 -38.46,14.63 -24.19,14.63 | -24.19,14.63 -22.53,16.29 | -22.53,16.29 | -22.53,16.29 -21.96,16.85 | -21.96,16.85 TRF1.22 | -24.19,14.63 -23.49,14.63 | -20.86,17.26 -21.47,16.65 | -21.47,16.65 -22.15,15.97 | -22.15,15.97 -23.49,14.63 | -23.49,14.63 -22.72,14.63 | -22.72,14.63 -21.64,15.71 | -21.64,15.71 -20.81,16.54 | -20.81,16.54 -20.3,17.05 | -22.72,14.63 -22.4,14.63 | -22.4,14.63 -21.4,15.63 | -21.4,15.63 -20.48,16.55 | -20.48,16.55 -19.24,17.79 -19.51,18.06 -20.69,18.06 | -22.4,14.63 -21.55,14.63 | -18.96,17.22 -20.64,15.54 | -20.64,15.54 -21.55,14.63 | -21.55,14.63 -21.28,14.63 | -21.28,14.63 -20.34,15.57 | -20.34,15.57 -18.69,17.22 | -21.28,14.63 -20.45,14.63 -18.05,17.03 | -18.05,17.03 -17.93,17.15 | -22.53,16.29 | -21.41,16.63 -20.38,16.95 -21.41,16.63 | -22.53,16.29 -22.29,17.07 | -22.29,17.07 -21.87,18.44 -22.29,17.07 | -21.64,15.71 -20.69,16.53 | -21.89,18.83 | -20.69,16.53 | -20.69,16.53 | -20.69,16.53 -21.77,18.51 | -21.85,18.67 | -21.64,15.71 -20.69,16.53 | -20.69,16.53 -19.94,17.19 -20.69,16.53 | -21.06,16.56 -19.75,18.39 | -20.69,16.53 | -20.54,16.54 -19.63,18.6 | -21.77,18.51 | -22.15,15.97 -21.06,16.56 | -21.06,16.56 | -21.06,16.56 | -21.06,16.56 | -21.06,16.56 -20.16,17.04 | -21.4,15.63 -20.54,16.54 | -20.54,16.54 -19.85,17.27 | -21.06,16.56 | -21.06,16.56 -19.75,18.39 | -21.06,16.56 | -22.53,16.29 | -22.15,15.97 -21.06,16.56 | -21.06,16.56 | -21.06,16.56 -20.16,17.04 | -21.06,16.56 | -21.06,16.56 -19.75,18.39 | -21.06,16.56 -21.84,18.67 | -17.16,16.98 -16.91,19.22 | -16.91,19.22 | -17.16,16.98 -16.91,19.22 | -17.16,16.98 | -17.16,16.98 -16.91,19.22 | -18.05,17.03 -17.16,16.98
  Top 0.61: -17.16,16.98 | -17.16,16.98 -15.8,16.9 | -18.05,17.03 -17.7,17.48 | -17.7,17.48 -16.67,18.82 | -18.05,17.03 -17.16,16.98 | -17.16,16.98 -15.8,16.9 | -18.05,17.03 -17.7,17.48 | -17.7,17.48 -16.67,18.82 | -19.75,18.39 | -21.06,16.56 -21.84,18.67 | -22.53,16.29 -21.41,16.63 | -22.53,16.29 -22.29,17.07 | -22.53,16.29 -21.41,16.63 | -22.53,16.29 -22.29,17.07 | -22.15,15.97 -20.16,17.04 | -22.15,15.97 -22.05,16.91 | -22.05,16.91 -21.91,18.21 | -21.64,15.71 -20.69,16.53 | -21.64,15.71 -21.77,16.76 | -21.77,16.76 -21.91,17.95 | -21.4,15.63 -20.54,16.54 | -20.54,16.54 -19.85,17.27 | -21.4,15.63 | -21.64,16.7 -21.89,17.83 -21.64,16.7 | -21.4,15.63 -20.54,16.54 | -20.54,16.54 -19.85,17.27 | -21.4,15.63 -21.64,16.7 | -20.64,15.54 -19.65,17.57 | -20.64,15.54 -21.24,16.59 | -21.24,16.59 -21.76,17.49 | -20.34,15.57 -19.96,16.65 | -19.96,16.65 -19.6,17.7 | -20.34,15.57 -21.07,16.56 | -21.07,16.56 -21.68,17.38 | -21.06,16.56 -21.84,18.67 | -21.06,16.56 -19.75,18.39 | -19.75,18.39 | -21.06,16.56 -21.84,18.67 | -21.84,18.67 | -20.12,16.61 -21.62,18.29 | -21.06,16.56 -19.75,18.39 | -19.75,18.39 | -21.06,16.56 -21.84,18.67 | -20.69,16.53 -21.77,18.51 | -21.77,18.51 | -21.06,16.56 -19.75,18.39 | -21.06,16.56 -21.84,18.67 | -21.84,18.67 | -20.54,16.54 -19.63,18.6 | -20.54,16.54 -21.74,18.45 -20.54,16.54 | -21.41,16.63 -19.86,18.26 | -21.41,16.63 -21.89,18.83 | -22.29,17.07 -20.23,17.99 | -22.29,17.07 -21.9,19.29 | -21.06,16.56 -19.75,18.39 | -21.06,16.56 -21.84,18.67 | -22.05,16.91 -20.11,18.06 | -22.05,16.91 -21.92,19.15 | -20.69,16.53 -19.66,18.54 | -19.66,18.54 | -20.69,16.53 -21.77,18.51 | -20.69,16.53 -19.66,18.54 | -20.69,16.53 -21.77,18.51 | -21.77,16.76 -19.99,18.14 | -21.77,16.76 -21.92,19
  Top 0.61: -20.54,16.54 -19.63,18.6 | -21.64,16.7 -19.94,18.18 | -21.64,16.7 -21.91,18.94 | -20.12,16.61 -19.57,18.79 | -20.12,16.61 -21.62,18.29 | -21.24,16.59 -19.8,18.32 | -21.24,16.59 -21.87,18.75 | -19.96,16.65 -19.55,18.87 | -19.96,16.65 -21.56,18.23 | -21.07,16.56 -19.76,18.39 | -21.07,16.56 -21.85,18.67 | -21.96,16.85 -20.07,18.08 | -21.96,16.85 -21.92,19.11 | -21.47,16.65 -19.88,18.24 | -21.47,16.65 -21.9,18.86 | -20.81,16.54 -19.69,18.49 | -20.81,16.54 -21.8,18.56 | -20.48,16.55 -19.62,18.63 | -20.48,16.55 -21.72,18.43 | -17.7,17.48 | -17.16,16.98 -15.17,18.03 | -15.17,18.03 | -17.16,16.98 -16.91,19.22 | -17.7,17.48 -16.83,19.55 | -17.16,16.98 -16.91,19.22 | -17.7,17.48 -15.49,17.91 | -17.7,17.48 -16.83,19.55 | -17.16,16.98 -16.91,19.22 | -16.91,19.22 -17.16,16.98 | -17.7,17.48 -16.83,19.55 | -17.16,16.98 -15.17,18.03 | -17.16,16.98 -16.91,19.22 | -17.7,17.48 -15.49,17.91 | -15.49,17.91 | -17.7,17.48 | -17.16,16.98 -15.17,18.03 | -17.7,17.48 -15.49,17.91 | -17.7,17.48 -16.83,19.55 | -18.05,17.03 -15.8,16.9 | -15.8,16.9 | -18.05,17.03 -16.67,18.82 | -18.05,17.03 -15.8,16.9 | -18.05,17.03 -16.67,18.82
  Top 0.813: C36.1 -23.69,5.45 C37.1 | C72.2 10.95,-34.77 10.92,-34.8 | -45.55,17.83 -45.49,17.13 C88.P$1 -44.85,17.77 -45.55,17.83
  Top 1.016: C86.1 -3.27,-15.53 L4.1
  Bottom 0.508: v-17.08,-31.24 -16.76,-30.92 -16.76,-30.82 | -16.76,-30.82 -16.76,-30.68 | -16.76,-30.68 -16.76,-22.04 -10.98,-16.26 -3.5,-16.26 -2.77,-15.54 | -2.77,-15.54 -1.72,-14.48 | -2.77,-15.54 -1.29,-14.7 | -16.76,-30.68 -17.17,-31.16 | v-17.08,-31.24 -17.17,-31.16 | -16.76,-30.68 -16.8,-30.8 | -16.76,-30.82 -17.16,-31.14 v-17.08,-31.24 | -16.76,-30.82 -16.97,-31.29 v-17.08,-31.24 | -17.17,-31.16 -16.84,-30.77 -16.96,-31.27 v-17.08,-31.24 | v-17.08,-31.24 -17.17,-31.16 | -16.8,-30.8 -17.17,-31.15 v-17.08,-31.24 | -16.8,-30.8 -16.96,-31.28 v-17.08,-31.24
  Bottom 1.5: 11.53,29.69 C73.1 14.79,30.66 C18.P$1 15.84,30.57 14.96,29.69 11.53,29.69 | 11.53,29.69 5.48,29.69 4.22,30.95 C24.P$1
  other vias: -5.27,-13.33 -4.27,-13.33 -3.17,-13.33 -2.17,-13.33 -5.3,-11.32 -4.3,-11.32 -3.2,-11.32 -2.2,-11.32 1.99,-10.23 0.99,-10.23 -0.11,-10.23 -1.11,-10.23 -5.27,-10.21 -4.27,-10.21 -3.17,-10.21 -2.17,-10.21 2.02,-9.12 1.02,-9.12 -0.08,-9.12 -1.08,-9.12 -5.23,-9.16 -4.23,-9.16 -3.13,-9.16 -2.13,-9.16 1.06,-8.07 -0.04,-8.07 -1.04,-8.07 -5.28,-12.35 -4.28,-12.35 -3.18,-12.35 -2.18,-12.35 -5.24,-8.07 -4.24,-8.07 -3.14,-8.07 -2.14,-8.07 -5.21,-6.96 -4.21,-6.96 -3.11,-6.96 -2.11,-6.96 -5.17,-5.91 -4.17,-5.91 -3.07,-5.91 -2.07,-5.91 -1,-6.95 -1,-5.91 0.05,-6.94 0.11,-5.94 -1.12,-11.33
  pour Top (isolate 0.305, no thermals): -40.57,15.82 -38.05,18.34 -38.05,20.74 -37.64,21.15 -22.43,21.15 -22.1,20.82 -22.1,17.14 -21.66,16.7 -14.71,16.7 -14.34,17.07 -14.34,21.62 -13.18,22.78 -1.09,22.78 5.1,28.97 5.1,32.47 4.58,32.99 3.85,32.99 3.36,32.5 3.36,31.12 -2.76,25 -37.06,25 -43.12,18.94 -43.12,19 -44.73,19 -45.39,18.34 -45.39,16.48 -44.73,15.82
  pour Bottom (isolate 0.305, no thermals): -21.96,16.58 -23.36,15.18 -23.36,12.97 -24.04,12.29 -24.04,1.29 -23.44,0.69 -21.18,0.69 -6.2,-14.24 -6.11,-14.33 -6.11,-15.66 -6.69,-16.24 -6.54,-16.39 -4.23,-16.4 -4.15,-16.32 -1.93,-16.32 -0.74,-15.13 -0.74,-11.74 -0.16,-11.16 5.47,-11.16 5.93,-10.7 5.93,-6.23 -1.89,1.59 -4.61,1.59 -5.73,2.71 -5.73,7.58 -12.88,14.73 -12.88,19.97 -13.29,20.38 -21.74,20.38 -21.96,20.16
  pour Top (isolate 0.305, no thermals): -6.14,-9.97 -8.64,-7.47 -8.64,-5.49 -8.26,-5.11 4.64,-5.11 5.75,-6.22 5.75,-10.27 5.27,-10.75 0.48,-10.75 -1.15,-12.38 -1.15,-15.61 -1.48,-15.94 -5.69,-15.94 -6.14,-15.49
+3V3  (via drill 0.35)
  Top 0.254: -54.66,-26.44 R100.2 | -30.6,-18.31 -31.4,-17.52